# EAGLE schematic Keyboard (EAGLE 8.1.1)
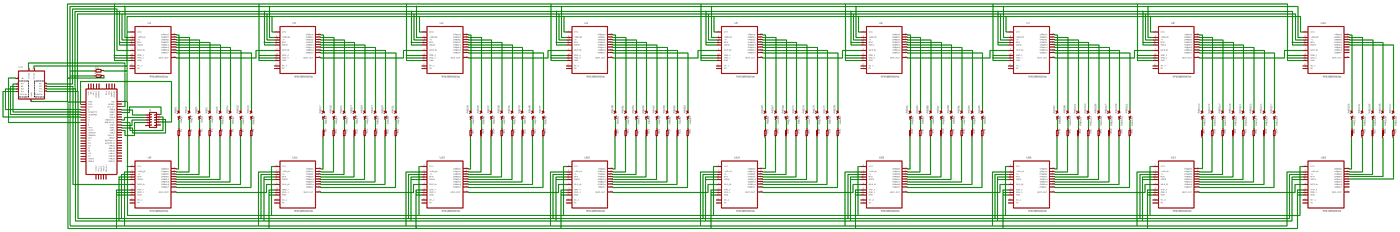
[diagram p0: schematic, sheet 1, overview]
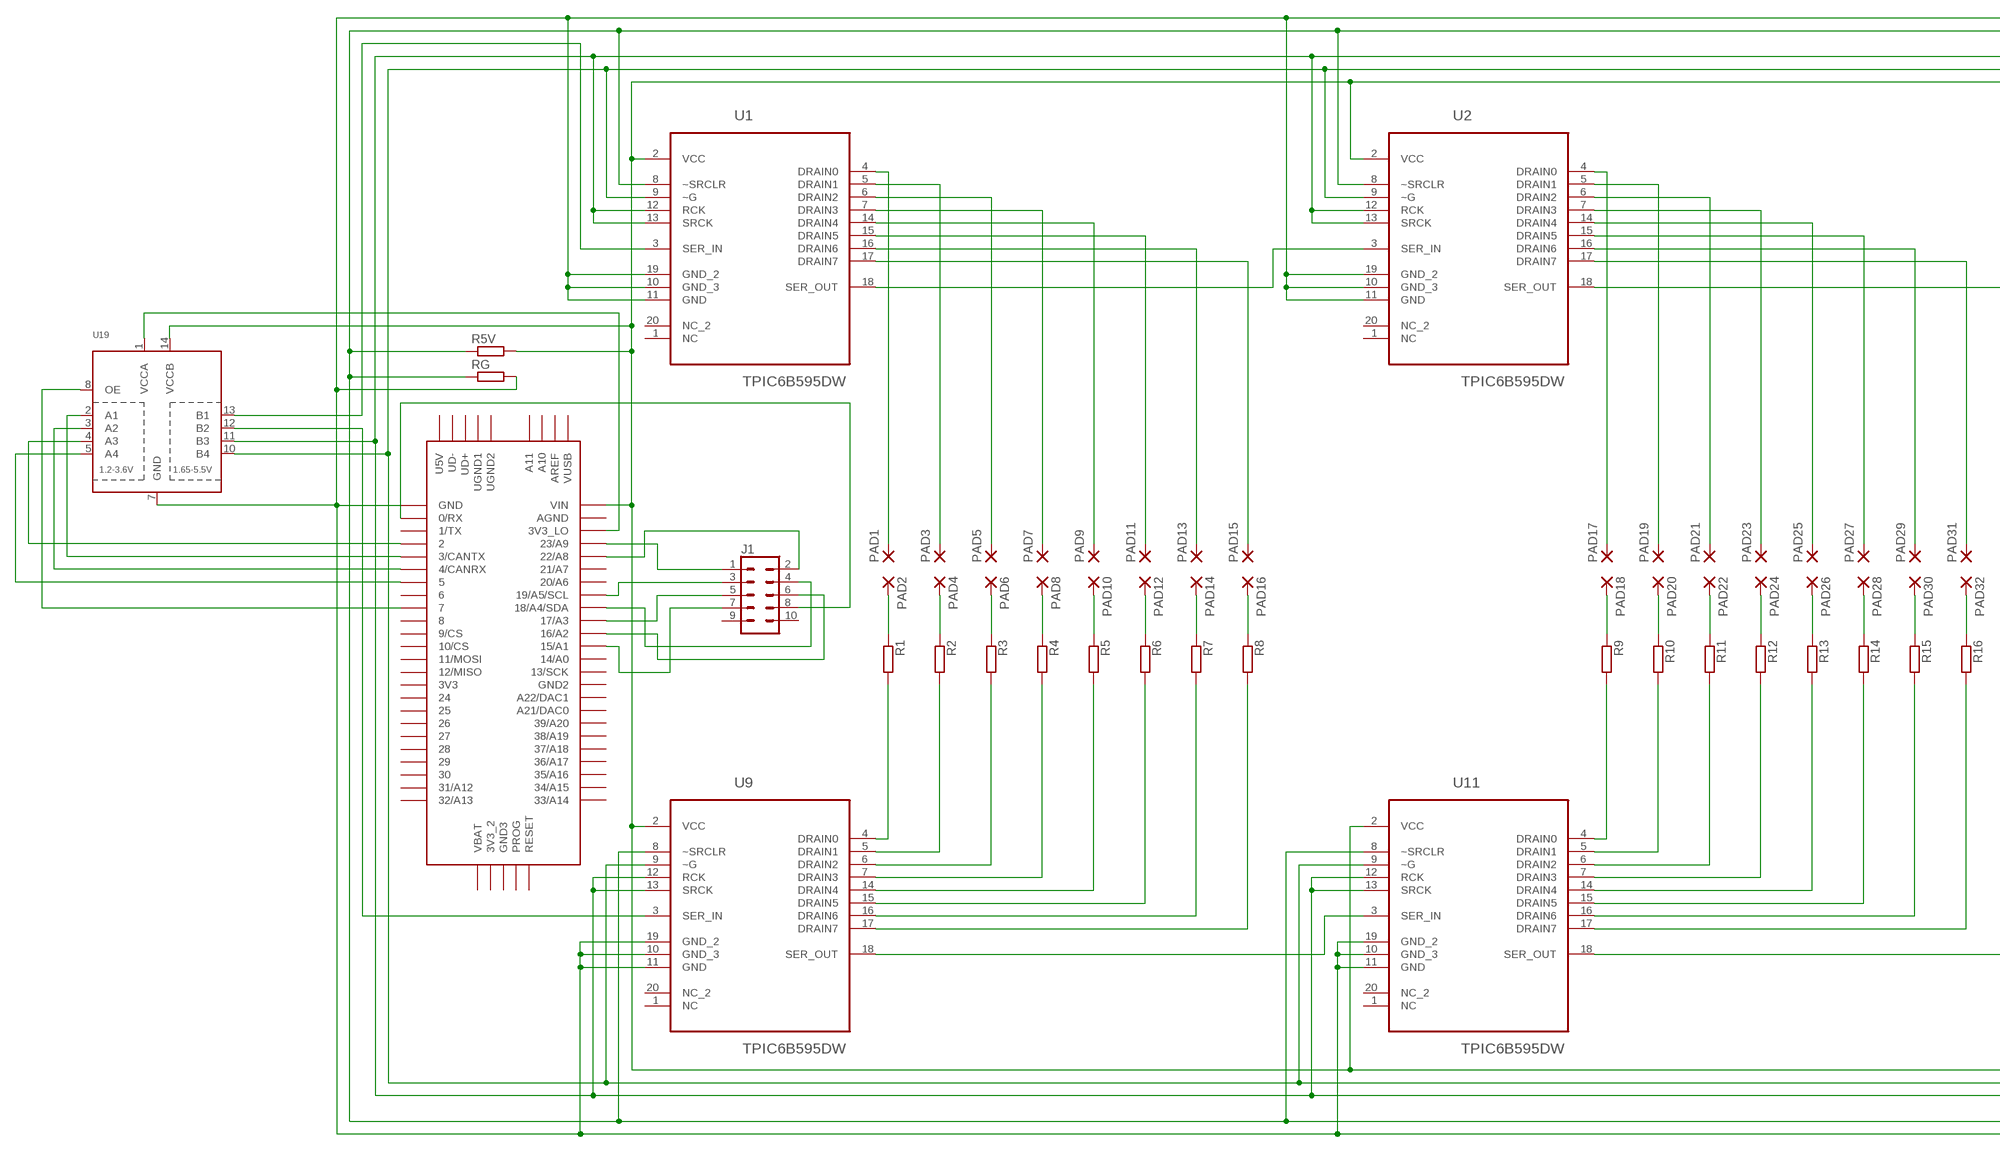
[diagram p1: schematic, sheet 1, part 1 of 4]
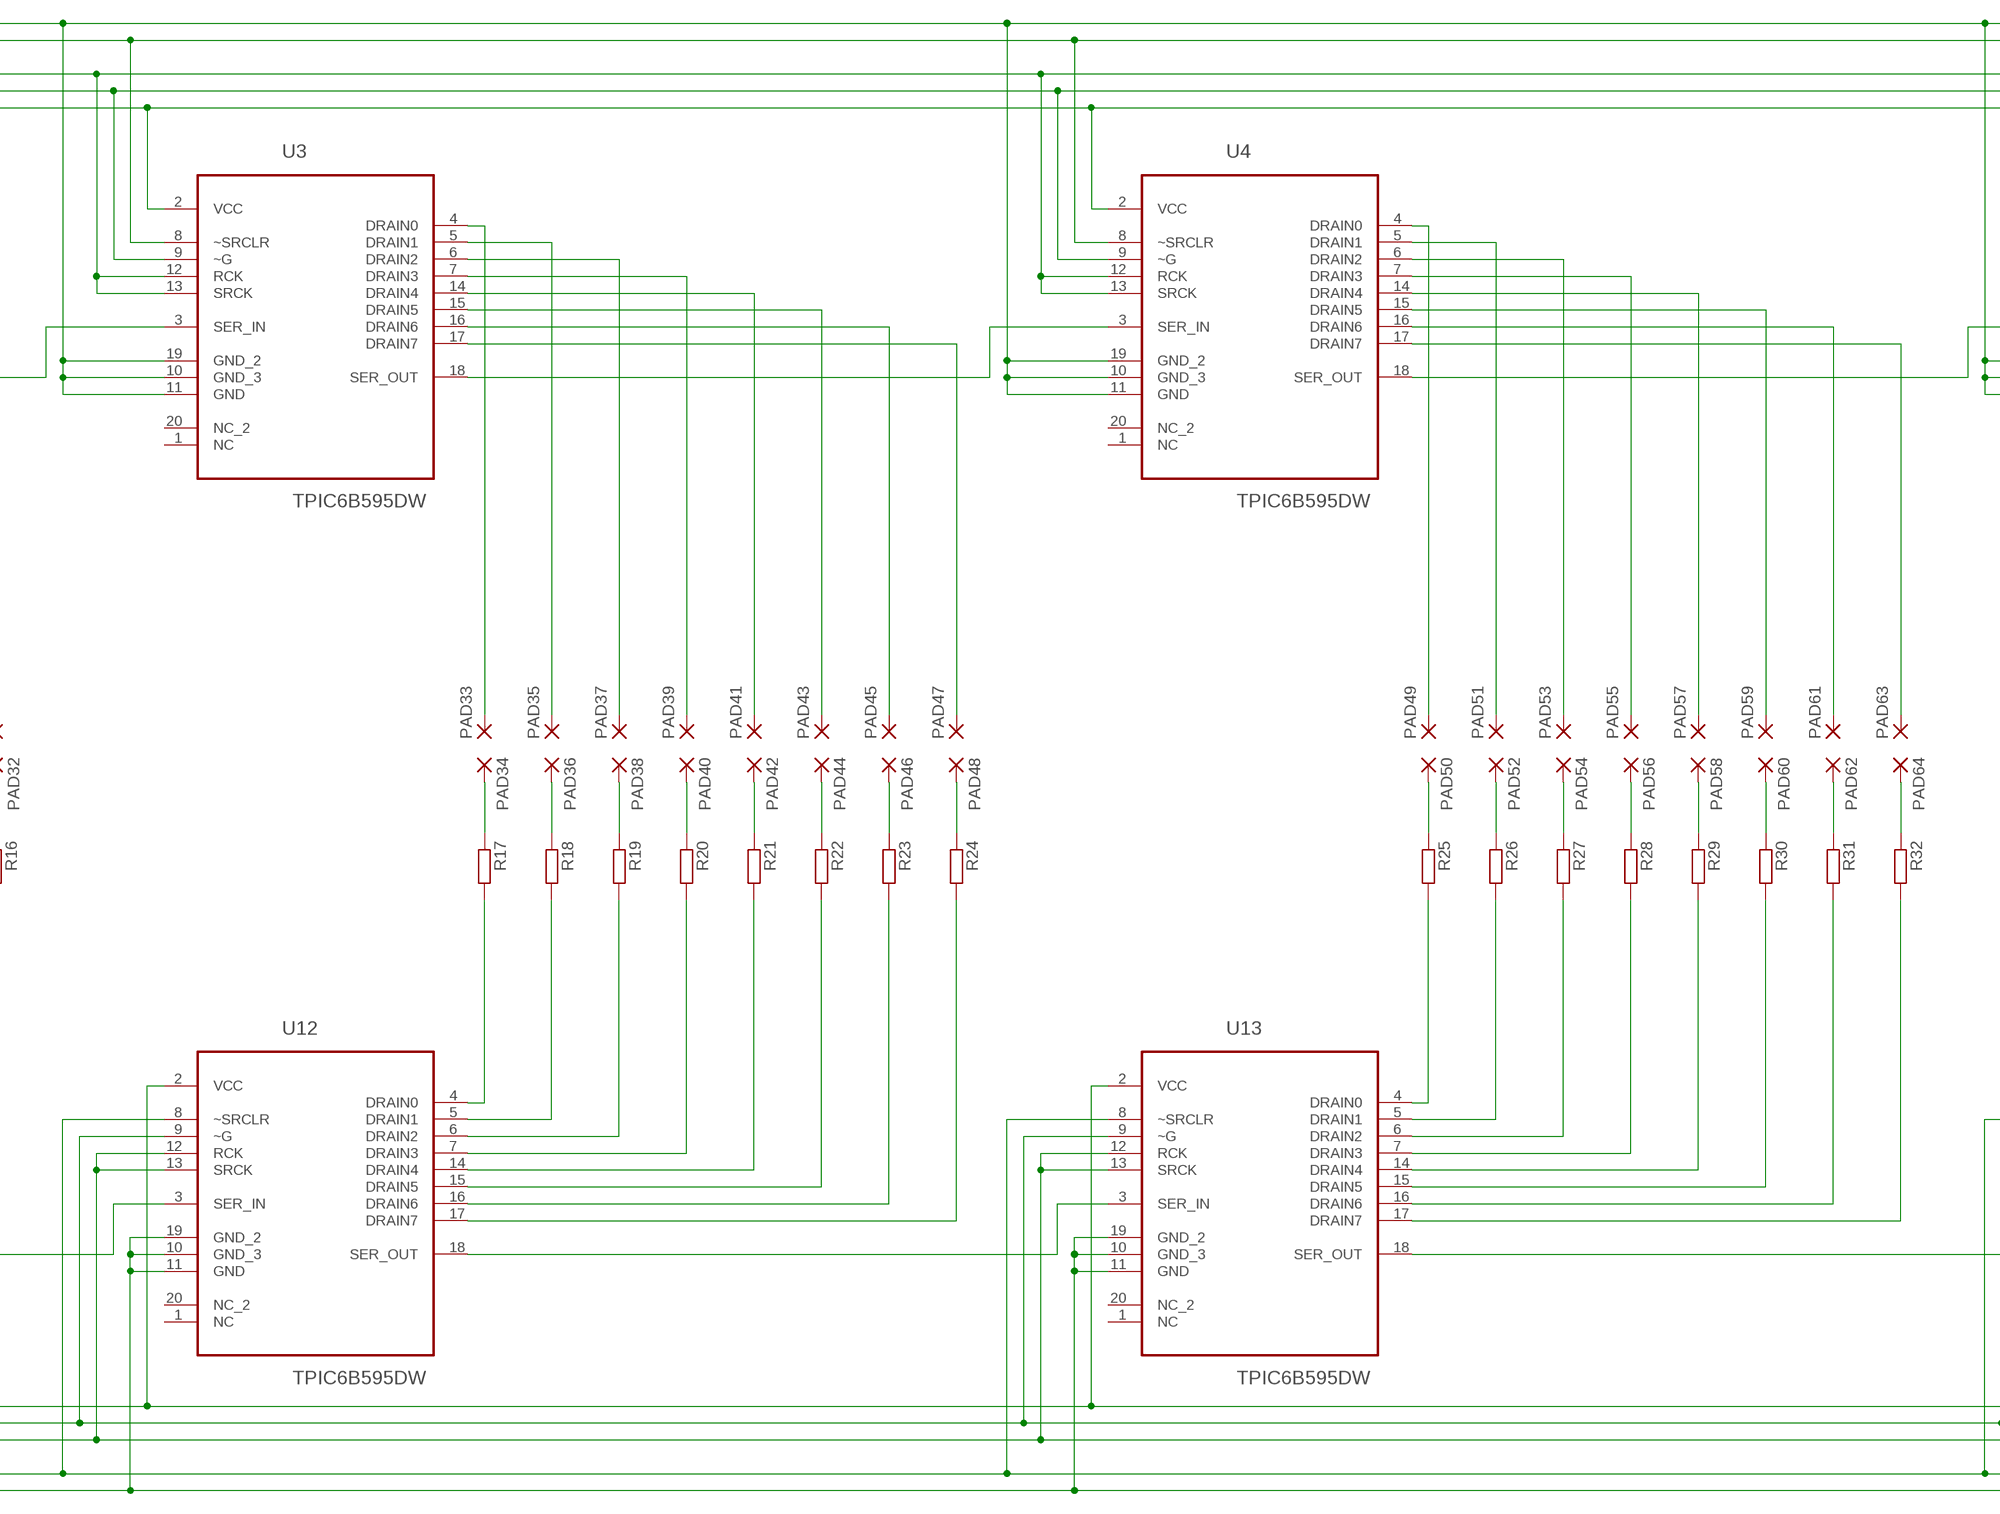
[diagram p2: schematic, sheet 1, part 2 of 4]
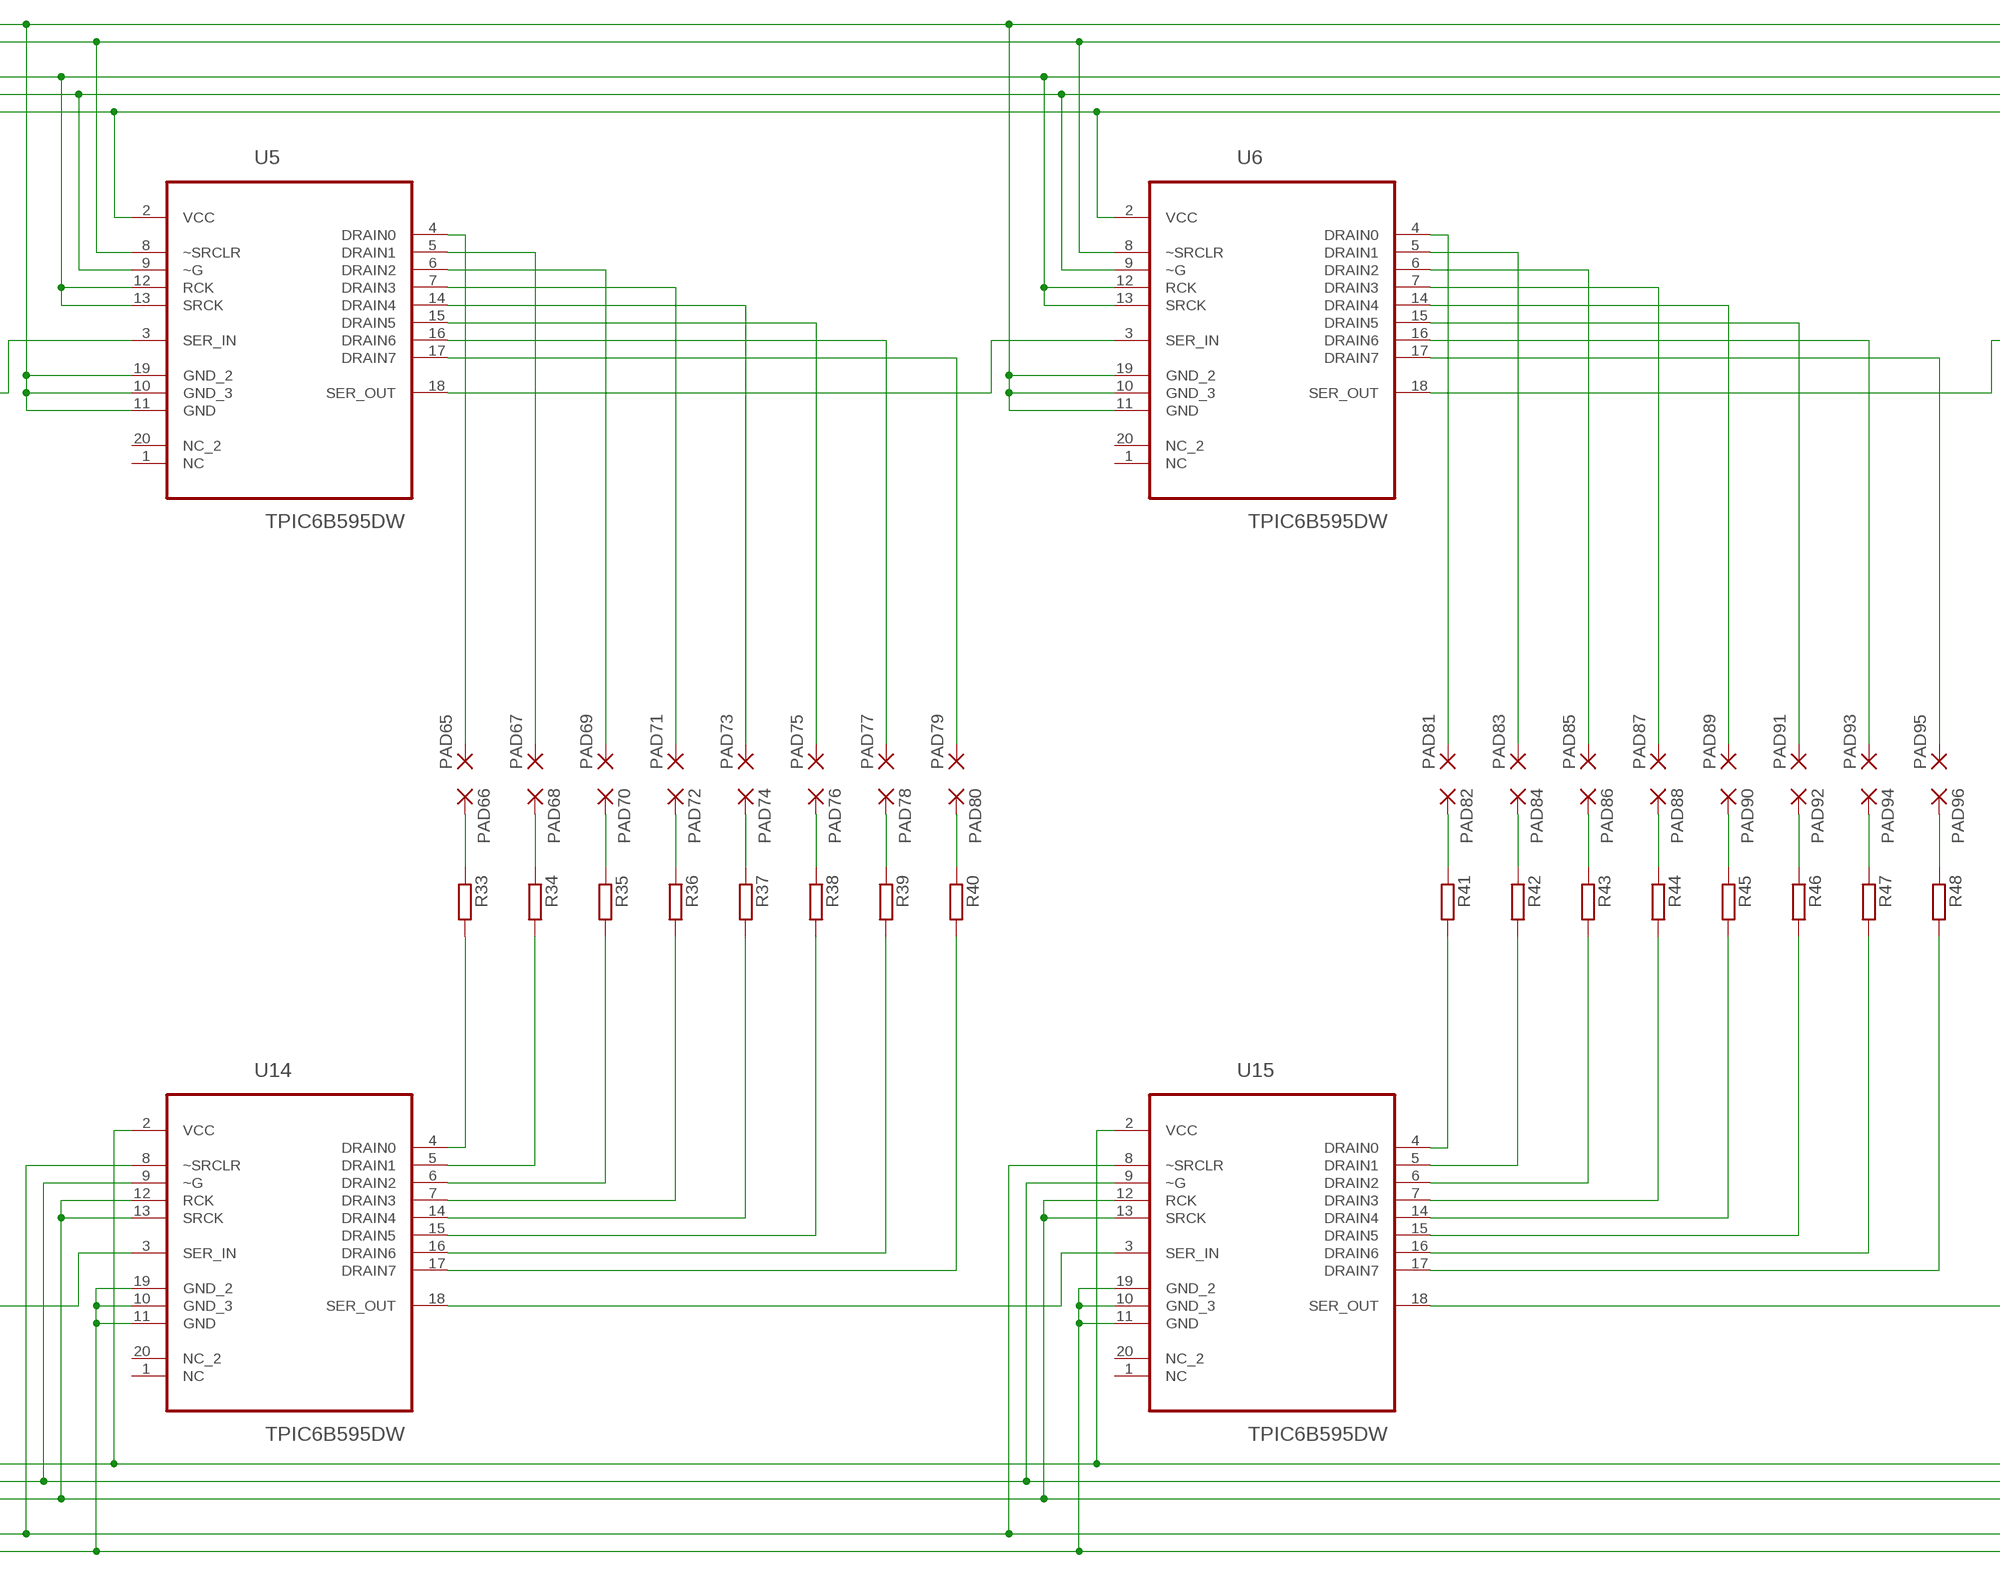
[diagram p3: schematic, sheet 1, part 3 of 4]
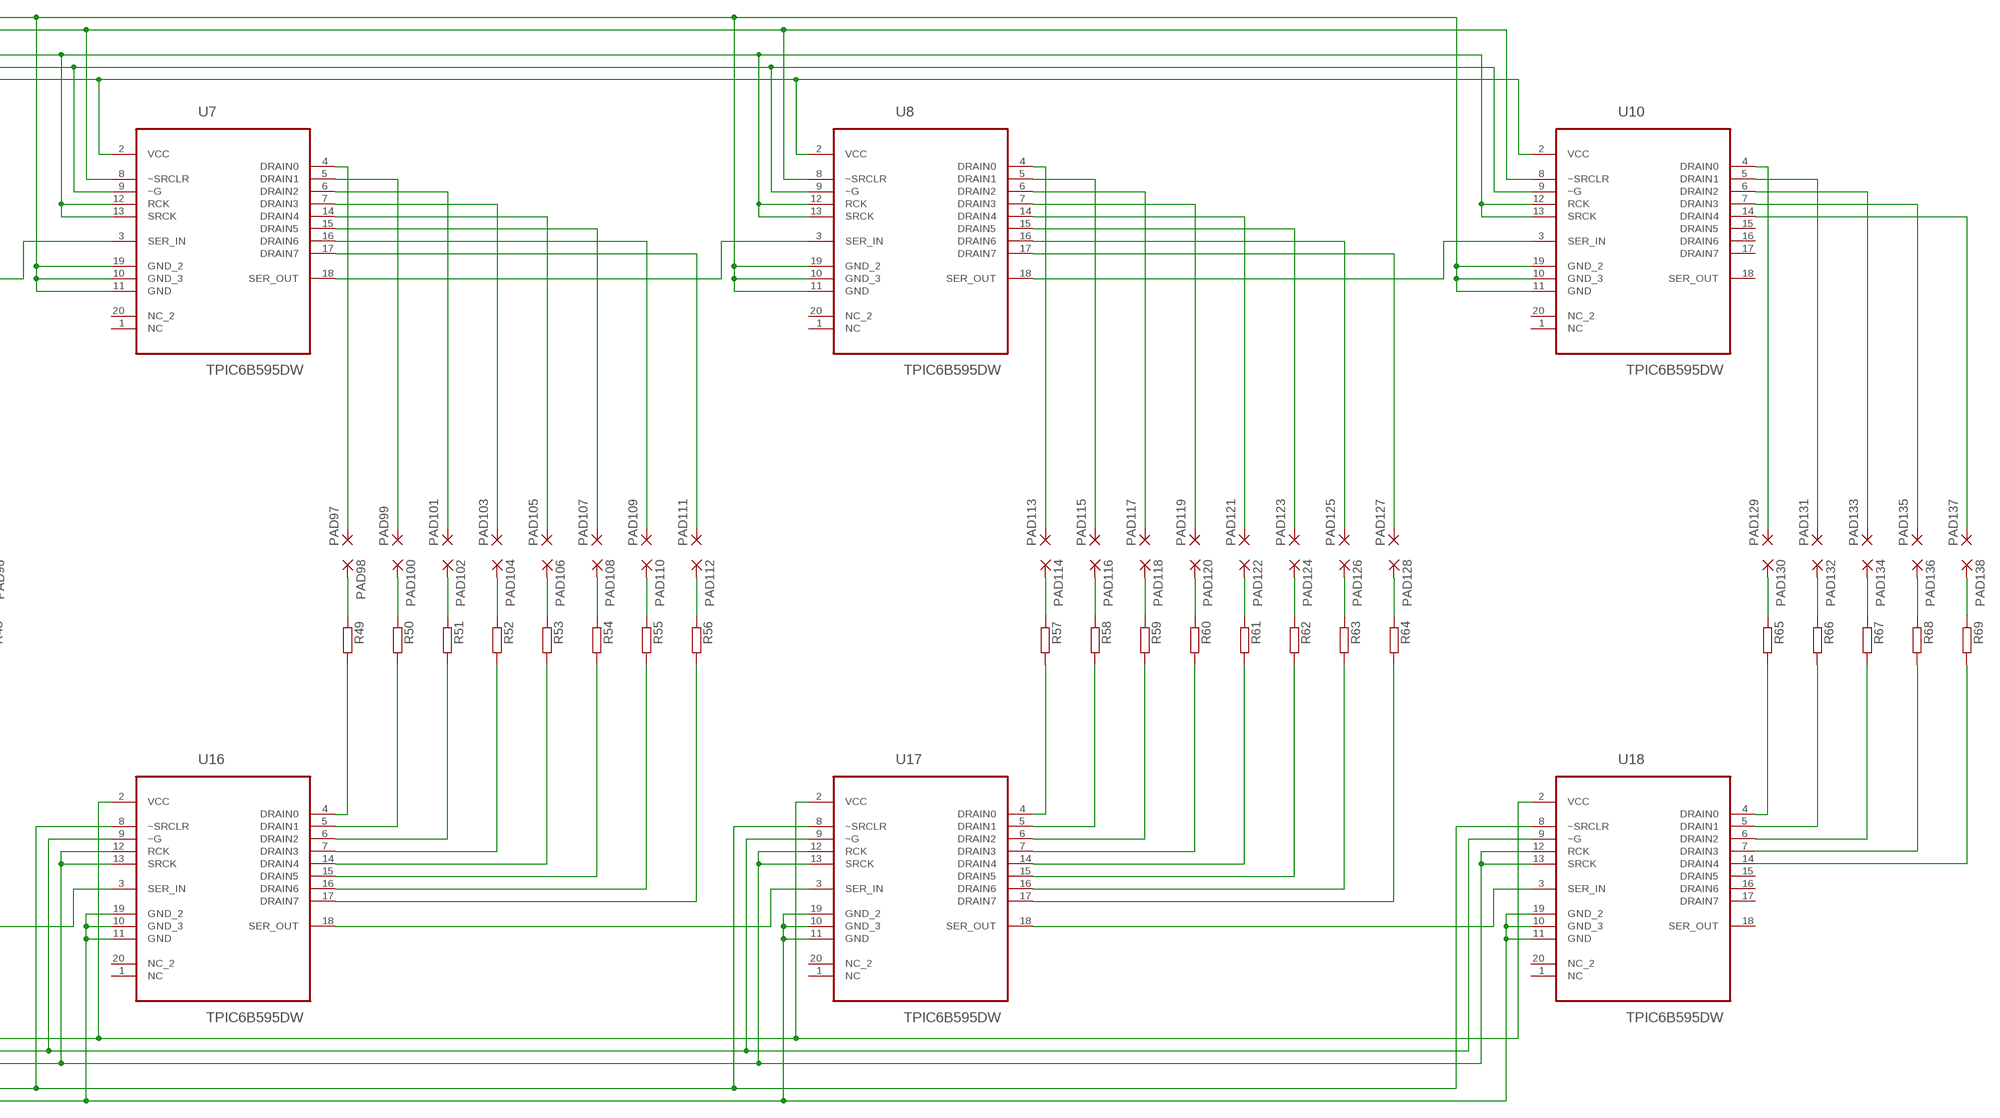
[diagram p4: schematic, sheet 1, part 4 of 4]

## Parts
J1  CONN_05X2SHD  [2X5-SHROUDED]
PAD1  1,6/0,8  [1,6/0,8]
PAD2  1,6/0,8  [1,6/0,8]
PAD3  1,6/0,8  [1,6/0,8]
PAD4  1,6/0,8  [1,6/0,8]
PAD5  1,6/0,8  [1,6/0,8]
PAD6  1,6/0,8  [1,6/0,8]
PAD7  1,6/0,8  [1,6/0,8]
PAD8  1,6/0,8  [1,6/0,8]
PAD9  1,6/0,8  [1,6/0,8]
PAD10  1,6/0,8  [1,6/0,8]
PAD11  1,6/0,8  [1,6/0,8]
PAD12  1,6/0,8  [1,6/0,8]
PAD13  1,6/0,8  [1,6/0,8]
PAD14  1,6/0,8  [1,6/0,8]
PAD15  1,6/0,8  [1,6/0,8]
PAD16  1,6/0,8  [1,6/0,8]
PAD17  1,6/0,8  [1,6/0,8]
PAD18  1,6/0,8  [1,6/0,8]
PAD19  1,6/0,8  [1,6/0,8]
PAD20  1,6/0,8  [1,6/0,8]
PAD21  1,6/0,8  [1,6/0,8]
PAD22  1,6/0,8  [1,6/0,8]
PAD23  1,6/0,8  [1,6/0,8]
PAD24  1,6/0,8  [1,6/0,8]
PAD25  1,6/0,8  [1,6/0,8]
PAD26  1,6/0,8  [1,6/0,8]
PAD27  1,6/0,8  [1,6/0,8]
PAD28  1,6/0,8  [1,6/0,8]
PAD29  1,6/0,8  [1,6/0,8]
PAD30  1,6/0,8  [1,6/0,8]
PAD31  1,6/0,8  [1,6/0,8]
PAD32  1,6/0,8  [1,6/0,8]
PAD33  1,6/0,8  [1,6/0,8]
PAD34  1,6/0,8  [1,6/0,8]
PAD35  1,6/0,8  [1,6/0,8]
PAD36  1,6/0,8  [1,6/0,8]
PAD37  1,6/0,8  [1,6/0,8]
PAD38  1,6/0,8  [1,6/0,8]
PAD39  1,6/0,8  [1,6/0,8]
PAD40  1,6/0,8  [1,6/0,8]
PAD41  1,6/0,8  [1,6/0,8]
PAD42  1,6/0,8  [1,6/0,8]
PAD43  1,6/0,8  [1,6/0,8]
PAD44  1,6/0,8  [1,6/0,8]
PAD45  1,6/0,8  [1,6/0,8]
PAD46  1,6/0,8  [1,6/0,8]
PAD47  1,6/0,8  [1,6/0,8]
PAD48  1,6/0,8  [1,6/0,8]
PAD49  1,6/0,8  [1,6/0,8]
PAD50  1,6/0,8  [1,6/0,8]
PAD51  1,6/0,8  [1,6/0,8]
PAD52  1,6/0,8  [1,6/0,8]
PAD53  1,6/0,8  [1,6/0,8]
PAD54  1,6/0,8  [1,6/0,8]
PAD55  1,6/0,8  [1,6/0,8]
PAD56  1,6/0,8  [1,6/0,8]
PAD57  1,6/0,8  [1,6/0,8]
PAD58  1,6/0,8  [1,6/0,8]
PAD59  1,6/0,8  [1,6/0,8]
PAD60  1,6/0,8  [1,6/0,8]
PAD61  1,6/0,8  [1,6/0,8]
PAD62  1,6/0,8  [1,6/0,8]
PAD63  1,6/0,8  [1,6/0,8]
PAD64  1,6/0,8  [1,6/0,8]
PAD65  1,6/0,8  [1,6/0,8]
PAD66  1,6/0,8  [1,6/0,8]
PAD67  1,6/0,8  [1,6/0,8]
PAD68  1,6/0,8  [1,6/0,8]
PAD69  1,6/0,8  [1,6/0,8]
PAD70  1,6/0,8  [1,6/0,8]
PAD71  1,6/0,8  [1,6/0,8]
PAD72  1,6/0,8  [1,6/0,8]
PAD73  1,6/0,8  [1,6/0,8]
PAD74  1,6/0,8  [1,6/0,8]
PAD75  1,6/0,8  [1,6/0,8]
PAD76  1,6/0,8  [1,6/0,8]
PAD77  1,6/0,8  [1,6/0,8]
PAD78  1,6/0,8  [1,6/0,8]
PAD79  1,6/0,8  [1,6/0,8]
PAD80  1,6/0,8  [1,6/0,8]
PAD81  1,6/0,8  [1,6/0,8]
PAD82  1,6/0,8  [1,6/0,8]
PAD83  1,6/0,8  [1,6/0,8]
PAD84  1,6/0,8  [1,6/0,8]
PAD85  1,6/0,8  [1,6/0,8]
PAD86  1,6/0,8  [1,6/0,8]
PAD87  1,6/0,8  [1,6/0,8]
PAD88  1,6/0,8  [1,6/0,8]
PAD89  1,6/0,8  [1,6/0,8]
PAD90  1,6/0,8  [1,6/0,8]
PAD91  1,6/0,8  [1,6/0,8]
PAD92  1,6/0,8  [1,6/0,8]
PAD93  1,6/0,8  [1,6/0,8]
PAD94  1,6/0,8  [1,6/0,8]
PAD95  1,6/0,8  [1,6/0,8]
PAD96  1,6/0,8  [1,6/0,8]
PAD97  1,6/0,8  [1,6/0,8]
PAD98  1,6/0,8  [1,6/0,8]
PAD99  1,6/0,8  [1,6/0,8]
PAD100  1,6/0,8  [1,6/0,8]
PAD101  1,6/0,8  [1,6/0,8]
PAD102  1,6/0,8  [1,6/0,8]
PAD103  1,6/0,8  [1,6/0,8]
PAD104  1,6/0,8  [1,6/0,8]
PAD105  1,6/0,8  [1,6/0,8]
PAD106  1,6/0,8  [1,6/0,8]
PAD107  1,6/0,8  [1,6/0,8]
PAD108  1,6/0,8  [1,6/0,8]
PAD109  1,6/0,8  [1,6/0,8]
PAD110  1,6/0,8  [1,6/0,8]
PAD111  1,6/0,8  [1,6/0,8]
PAD112  1,6/0,8  [1,6/0,8]
PAD113  1,6/0,8  [1,6/0,8]
PAD114  1,6/0,8  [1,6/0,8]
PAD115  1,6/0,8  [1,6/0,8]
PAD116  1,6/0,8  [1,6/0,8]
PAD117  1,6/0,8  [1,6/0,8]
PAD118  1,6/0,8  [1,6/0,8]
PAD119  1,6/0,8  [1,6/0,8]
PAD120  1,6/0,8  [1,6/0,8]
PAD121  1,6/0,8  [1,6/0,8]
PAD122  1,6/0,8  [1,6/0,8]
PAD123  1,6/0,8  [1,6/0,8]
PAD124  1,6/0,8  [1,6/0,8]
PAD125  1,6/0,8  [1,6/0,8]
PAD126  1,6/0,8  [1,6/0,8]
PAD127  1,6/0,8  [1,6/0,8]
PAD128  1,6/0,8  [1,6/0,8]
PAD129  1,6/0,8  [1,6/0,8]
PAD130  1,6/0,8  [1,6/0,8]
PAD131  1,6/0,8  [1,6/0,8]
PAD132  1,6/0,8  [1,6/0,8]
PAD133  1,6/0,8  [1,6/0,8]
PAD134  1,6/0,8  [1,6/0,8]
PAD135  1,6/0,8  [1,6/0,8]
PAD136  1,6/0,8  [1,6/0,8]
PAD137  1,6/0,8  [1,6/0,8]
PAD138  1,6/0,8  [1,6/0,8]
R1  R  [R0805]
R2  R  [R0805]
R3  R  [R0805]
R4  R  [R0805]
R5  R  [R0805]
R5V  R  [R0805]
R6  R  [R0805]
R7  R  [R0805]
R8  R  [R0805]
R9  R  [R0805]
R10  R  [R0805]
R11  R  [R0805]
R12  R  [R0805]
R13  R  [R0805]
R14  R  [R0805]
R15  R  [R0805]
R16  R  [R0805]
R17  R  [R0805]
R18  R  [R0805]
R19  R  [R0805]
R20  R  [R0805]
R21  R  [R0805]
R22  R  [R0805]
R23  R  [R0805]
R24  R  [R0805]
R25  R  [R0805]
R26  R  [R0805]
R27  R  [R0805]
R28  R  [R0805]
R29  R  [R0805]
R30  R  [R0805]
R31  R  [R0805]
R32  R  [R0805]
R33  R  [R0805]
R34  R  [R0805]
R35  R  [R0805]
R36  R  [R0805]
R37  R  [R0805]
R38  R  [R0805]
R39  R  [R0805]
R40  R  [R0805]
R41  R  [R0805]
R42  R  [R0805]
R43  R  [R0805]
R44  R  [R0805]
R45  R  [R0805]
R46  R  [R0805]
R47  R  [R0805]
R48  R  [R0805]
R49  R  [R0805]
R50  R  [R0805]
R51  R  [R0805]
R52  R  [R0805]
R53  R  [R0805]
R54  R  [R0805]
R55  R  [R0805]
R56  R  [R0805]
R57  R  [R0805]
R58  R  [R0805]
R59  R  [R0805]
R60  R  [R0805]
R61  R  [R0805]
R62  R  [R0805]
R63  R  [R0805]
R64  R  [R0805]
R65  R  [R0805]
R66  R  [R0805]
R67  R  [R0805]
R68  R  [R0805]
R69  R  [R0805]
RG  R  [R0805]
U1  TPIC6B595DW  [SOIC127P1030X265-20N]
U2  TPIC6B595DW  [SOIC127P1030X265-20N]
U3  TPIC6B595DW  [SOIC127P1030X265-20N]
U4  TPIC6B595DW  [SOIC127P1030X265-20N]
U5  TPIC6B595DW  [SOIC127P1030X265-20N]
U6  TPIC6B595DW  [SOIC127P1030X265-20N]
U7  TPIC6B595DW  [SOIC127P1030X265-20N]
U8  TPIC6B595DW  [SOIC127P1030X265-20N]
U9  TPIC6B595DW  [SOIC127P1030X265-20N]
U10  TPIC6B595DW  [SOIC127P1030X265-20N]
U11  TPIC6B595DW  [SOIC127P1030X265-20N]
U12  TPIC6B595DW  [SOIC127P1030X265-20N]
U13  TPIC6B595DW  [SOIC127P1030X265-20N]
U14  TPIC6B595DW  [SOIC127P1030X265-20N]
U15  TPIC6B595DW  [SOIC127P1030X265-20N]
U16  TPIC6B595DW  [SOIC127P1030X265-20N]
U17  TPIC6B595DW  [SOIC127P1030X265-20N]
U18  TPIC6B595DW  [SOIC127P1030X265-20N]
U19  TXB0104PWRSOIC14  [SO14]
U$59  TEENSY_3.5/3.6  [TEENSY_3.5/3.6]

## Nets
N$1: PAD2.1(P) R1.1
N$2: U1.18(SER_OUT) U2.3(SER_IN)
N$3: U1.12(RCK) U1.13(SRCK) U2.12(RCK) U2.13(SRCK) U3.12(RCK) U3.13(SRCK) U4.12(RCK) U4.13(SRCK) U5.12(RCK) U5.13(SRCK) U6.12(RCK) U6.13(SRCK) U7.12(RCK) U7.13(SRCK) U8.12(RCK) U8.13(SRCK) U9.12(RCK) U9.13(SRCK) U10.12(RCK) U10.13(SRCK) U11.12(RCK) U11.13(SRCK) U12.12(RCK) U12.13(SRCK) U13.12(RCK) U13.13(SRCK) U14.12(RCK) U14.13(SRCK) U15.12(RCK) U15.13(SRCK) U16.12(RCK) U16.13(SRCK) U17.12(RCK) U17.13(SRCK) U18.12(RCK) U18.13(SRCK) U19.11(B3)
N$4: PAD4.1(P) R2.1
N$5: PAD6.1(P) R3.1
N$6: PAD8.1(P) R4.1
N$7: PAD10.1(P) R5.1
N$8: PAD12.1(P) R6.1
N$9: PAD14.1(P) R7.1
N$10: PAD16.1(P) R8.1
N$11: PAD18.1(P) R9.1
N$12: U1.9(~G) U2.9(~G) U3.9(~G) U4.9(~G) U5.9(~G) U6.9(~G) U7.9(~G) U8.9(~G) U9.9(~G) U10.9(~G) U11.9(~G) U12.9(~G) U13.9(~G) U14.9(~G) U15.9(~G) U16.9(~G) U17.9(~G) U18.9(~G) U19.10(B4)
N$13: PAD20.1(P) R10.1
N$14: PAD22.1(P) R11.1
N$15: PAD24.1(P) R12.1
N$16: PAD26.1(P) R13.1
N$17: PAD28.1(P) R14.1
N$18: PAD30.1(P) R15.1
N$19: PAD32.1(P) R16.1
N$20: PAD34.1(P) R17.1
N$21: PAD36.1(P) R18.1
N$22: PAD38.1(P) R19.1
N$23: PAD40.1(P) R20.1
N$24: PAD42.1(P) R21.1
N$25: PAD44.1(P) R22.1
N$26: PAD46.1(P) R23.1
N$27: PAD48.1(P) R24.1
N$28: PAD50.1(P) R25.1
N$29: PAD52.1(P) R26.1
N$30: PAD54.1(P) R27.1
N$31: PAD56.1(P) R28.1
N$32: PAD58.1(P) R29.1
N$33: PAD60.1(P) R30.1
N$34: PAD62.1(P) R31.1
N$35: PAD64.1(P) R32.1
N$36: PAD66.1(P) R33.1
N$37: PAD68.1(P) R34.1
N$38: PAD70.1(P) R35.1
N$39: PAD72.1(P) R36.1
N$40: PAD74.1(P) R37.1
N$41: PAD76.1(P) R38.1
N$42: PAD78.1(P) R39.1
N$43: PAD80.1(P) R40.1
N$44: PAD82.1(P) R41.1
N$45: PAD84.1(P) R42.1
N$46: PAD86.1(P) R43.1
N$47: PAD88.1(P) R44.1
N$48: PAD90.1(P) R45.1
N$49: PAD92.1(P) R46.1
N$50: PAD94.1(P) R47.1
N$51: PAD96.1(P) R48.1
N$52: PAD98.1(P) R49.1
N$53: PAD100.1(P) R50.1
N$54: PAD102.1(P) R51.1
N$55: PAD104.1(P) R52.1
N$56: PAD106.1(P) R53.1
N$57: PAD108.1(P) R54.1
N$58: PAD110.1(P) R55.1
N$59: PAD112.1(P) R56.1
N$60: PAD114.1(P) R57.1
N$61: R5V.2 U1.2(VCC) U2.2(VCC) U3.2(VCC) U4.2(VCC) U5.2(VCC) U6.2(VCC) U7.2(VCC) U8.2(VCC) U9.2(VCC) U10.2(VCC) U11.2(VCC) U12.2(VCC) U13.2(VCC) U14.2(VCC) U15.2(VCC) U16.2(VCC) U17.2(VCC) U18.2(VCC) U19.14(VCCB) U$59.VIN
N$62: U19.4(A3) U$59.2
N$63: R5V.1 RG.1 U1.8(~SRCLR) U2.8(~SRCLR) U3.8(~SRCLR) U4.8(~SRCLR) U5.8(~SRCLR) U6.8(~SRCLR) U7.8(~SRCLR) U8.8(~SRCLR) U9.8(~SRCLR) U10.8(~SRCLR) U11.8(~SRCLR) U12.8(~SRCLR) U13.8(~SRCLR) U14.8(~SRCLR) U15.8(~SRCLR) U16.8(~SRCLR) U17.8(~SRCLR) U18.8(~SRCLR)
N$64: U1.3(SER_IN) U19.13(B1)
N$65: U2.18(SER_OUT) U3.3(SER_IN)
N$66: R68.2 U18.7(DRAIN3)
N$67: R69.2 U18.14(DRAIN4)
N$68: PAD129.1(P) U10.4(DRAIN0)
N$69: PAD131.1(P) U10.5(DRAIN1)
N$70: U3.18(SER_OUT) U4.3(SER_IN)
N$71: U4.18(SER_OUT) U5.3(SER_IN)
N$72: U5.18(SER_OUT) U6.3(SER_IN)
N$73: U6.18(SER_OUT) U7.3(SER_IN)
N$74: U7.18(SER_OUT) U8.3(SER_IN)
N$75: U8.18(SER_OUT) U10.3(SER_IN)
N$76: U19.1(VCCA) U$59.3V3_LO
N$77: U19.2(A1) U$59.3/CANTX
N$78: U9.3(SER_IN) U19.12(B2)
N$79: U19.8(OE) U$59.7
N$80: PAD116.1(P) R58.1
N$81: PAD118.1(P) R59.1
N$82: PAD120.1(P) R60.1
N$83: PAD122.1(P) R61.1
N$84: PAD124.1(P) R62.1
N$85: PAD126.1(P) R63.1
N$86: PAD128.1(P) R64.1
N$87: U9.18(SER_OUT) U11.3(SER_IN)
N$88: U11.18(SER_OUT) U12.3(SER_IN)
N$89: U12.18(SER_OUT) U13.3(SER_IN)
N$90: U13.18(SER_OUT) U14.3(SER_IN)
N$91: U14.18(SER_OUT) U15.3(SER_IN)
N$92: U15.18(SER_OUT) U16.3(SER_IN)
N$93: U16.18(SER_OUT) U17.3(SER_IN)
N$94: U17.18(SER_OUT) U18.3(SER_IN)
N$95: RG.2 U1.10(GND_3) U1.11(GND) U1.19(GND_2) U2.10(GND_3) U2.11(GND) U2.19(GND_2) U3.10(GND_3) U3.11(GND) U3.19(GND_2) U4.10(GND_3) U4.11(GND) U4.19(GND_2) U5.10(GND_3) U5.11(GND) U5.19(GND_2) U6.10(GND_3) U6.11(GND) U6.19(GND_2) U7.10(GND_3) U7.11(GND) U7.19(GND_2) U8.10(GND_3) U8.11(GND) U8.19(GND_2) U9.10(GND_3) U9.11(GND) U9.19(GND_2) U10.10(GND_3) U10.11(GND) U10.19(GND_2) U11.10(GND_3) U11.11(GND) U11.19(GND_2) U12.10(GND_3) U12.11(GND) U12.19(GND_2) U13.10(GND_3) U13.11(GND) U13.19(GND_2) U14.10(GND_3) U14.11(GND) U14.19(GND_2) U15.10(GND_3) U15.11(GND) U15.19(GND_2) U16.10(GND_3) U16.11(GND) U16.19(GND_2) U17.10(GND_3) U17.11(GND) U17.19(GND_2) U18.10(GND_3) U18.11(GND) U18.19(GND_2) U19.7(GND) U$59.GND
N$96: U19.5(A4) U$59.5
N$97: PAD130.1(P) R65.1
N$98: PAD1.1(P) U1.4(DRAIN0)
N$99: PAD3.1(P) U1.5(DRAIN1)
N$100: PAD5.1(P) U1.6(DRAIN2)
N$101: PAD7.1(P) U1.7(DRAIN3)
N$102: PAD9.1(P) U1.14(DRAIN4)
N$103: PAD11.1(P) U1.15(DRAIN5)
N$104: PAD13.1(P) U1.16(DRAIN6)
N$105: PAD15.1(P) U1.17(DRAIN7)
N$106: R1.2 U9.4(DRAIN0)
N$107: R2.2 U9.5(DRAIN1)
N$108: R3.2 U9.6(DRAIN2)
N$109: R4.2 U9.7(DRAIN3)
N$110: R5.2 U9.14(DRAIN4)
N$111: R6.2 U9.15(DRAIN5)
N$112: R7.2 U9.16(DRAIN6)
N$113: R8.2 U9.17(DRAIN7)
N$114: R9.2 U11.4(DRAIN0)
N$115: R10.2 U11.5(DRAIN1)
N$116: R11.2 U11.6(DRAIN2)
N$117: R12.2 U11.7(DRAIN3)
N$118: R13.2 U11.14(DRAIN4)
N$119: R14.2 U11.15(DRAIN5)
N$120: R15.2 U11.16(DRAIN6)
N$121: R16.2 U11.17(DRAIN7)
N$122: PAD17.1(P) U2.4(DRAIN0)
N$123: PAD19.1(P) U2.5(DRAIN1)
N$124: PAD21.1(P) U2.6(DRAIN2)
N$125: PAD23.1(P) U2.7(DRAIN3)
N$126: PAD25.1(P) U2.14(DRAIN4)
N$127: PAD27.1(P) U2.15(DRAIN5)
N$128: PAD29.1(P) U2.16(DRAIN6)
N$129: PAD31.1(P) U2.17(DRAIN7)
N$130: PAD33.1(P) U3.4(DRAIN0)
N$131: PAD35.1(P) U3.5(DRAIN1)
N$132: PAD37.1(P) U3.6(DRAIN2)
N$133: PAD39.1(P) U3.7(DRAIN3)
N$134: PAD41.1(P) U3.14(DRAIN4)
N$135: PAD43.1(P) U3.15(DRAIN5)
N$136: PAD45.1(P) U3.16(DRAIN6)
N$137: PAD47.1(P) U3.17(DRAIN7)
N$138: R17.2 U12.4(DRAIN0)
N$139: R18.2 U12.5(DRAIN1)
N$140: R19.2 U12.6(DRAIN2)
N$141: R20.2 U12.7(DRAIN3)
N$142: R21.2 U12.14(DRAIN4)
N$143: R22.2 U12.15(DRAIN5)
N$144: R23.2 U12.16(DRAIN6)
N$145: R24.2 U12.17(DRAIN7)
N$146: R25.2 U13.4(DRAIN0)
N$147: R26.2 U13.5(DRAIN1)
N$148: R27.2 U13.6(DRAIN2)
N$149: U19.3(A2) U$59.4/CANRX
N$150: R28.2 U13.7(DRAIN3)
N$151: R29.2 U13.14(DRAIN4)
N$152: R30.2 U13.15(DRAIN5)
N$153: R31.2 U13.16(DRAIN6)
N$154: R32.2 U13.17(DRAIN7)
N$155: PAD49.1(P) U4.4(DRAIN0)
N$156: PAD51.1(P) U4.5(DRAIN1)
N$157: PAD53.1(P) U4.6(DRAIN2)
N$158: PAD55.1(P) U4.7(DRAIN3)
N$159: PAD57.1(P) U4.14(DRAIN4)
N$160: PAD59.1(P) U4.15(DRAIN5)
N$161: PAD61.1(P) U4.16(DRAIN6)
N$162: PAD63.1(P) U4.17(DRAIN7)
N$163: PAD65.1(P) U5.4(DRAIN0)
N$164: PAD67.1(P) U5.5(DRAIN1)
N$165: PAD69.1(P) U5.6(DRAIN2)
N$166: PAD71.1(P) U5.7(DRAIN3)
N$167: PAD73.1(P) U5.14(DRAIN4)
N$168: PAD75.1(P) U5.15(DRAIN5)
N$169: PAD77.1(P) U5.16(DRAIN6)
N$170: PAD79.1(P) U5.17(DRAIN7)
N$171: R33.2 U14.4(DRAIN0)
N$172: R34.2 U14.5(DRAIN1)
N$173: R35.2 U14.6(DRAIN2)
N$174: R36.2 U14.7(DRAIN3)
N$175: R37.2 U14.14(DRAIN4)
N$176: R38.2 U14.15(DRAIN5)
N$177: R39.2 U14.16(DRAIN6)
N$178: R40.2 U14.17(DRAIN7)
N$179: R41.2 U15.4(DRAIN0)
N$180: R42.2 U15.5(DRAIN1)
N$181: R43.2 U15.6(DRAIN2)
N$182: R44.2 U15.7(DRAIN3)
N$183: R45.2 U15.14(DRAIN4)
N$184: R46.2 U15.15(DRAIN5)
N$185: R47.2 U15.16(DRAIN6)
N$186: R48.2 U15.17(DRAIN7)
N$187: PAD81.1(P) U6.4(DRAIN0)
N$188: PAD83.1(P) U6.5(DRAIN1)
N$189: PAD85.1(P) U6.6(DRAIN2)
N$190: PAD87.1(P) U6.7(DRAIN3)
N$191: PAD89.1(P) U6.14(DRAIN4)
N$192: PAD91.1(P) U6.15(DRAIN5)
N$193: PAD93.1(P) U6.16(DRAIN6)
N$194: PAD95.1(P) U6.17(DRAIN7)
N$195: R49.2 U16.4(DRAIN0)
N$196: R50.2 U16.5(DRAIN1)
N$197: R51.2 U16.6(DRAIN2)
N$198: R52.2 U16.7(DRAIN3)
N$199: R53.2 U16.14(DRAIN4)
N$200: R54.2 U16.15(DRAIN5)
N$201: R55.2 U16.16(DRAIN6)
N$202: R56.2 U16.17(DRAIN7)
N$203: PAD97.1(P) U7.4(DRAIN0)
N$204: PAD99.1(P) U7.5(DRAIN1)
N$205: PAD101.1(P) U7.6(DRAIN2)
N$206: PAD103.1(P) U7.7(DRAIN3)
N$207: PAD105.1(P) U7.14(DRAIN4)
N$208: PAD107.1(P) U7.15(DRAIN5)
N$209: PAD109.1(P) U7.16(DRAIN6)
N$210: PAD111.1(P) U7.17(DRAIN7)
N$211: PAD113.1(P) U8.4(DRAIN0)
N$212: PAD115.1(P) U8.5(DRAIN1)
N$213: PAD117.1(P) U8.6(DRAIN2)
N$214: PAD119.1(P) U8.7(DRAIN3)
N$215: PAD121.1(P) U8.14(DRAIN4)
N$216: PAD123.1(P) U8.15(DRAIN5)
N$217: PAD125.1(P) U8.16(DRAIN6)
N$218: PAD127.1(P) U8.17(DRAIN7)
N$219: R57.2 U17.4(DRAIN0)
N$220: R58.2 U17.5(DRAIN1)
N$221: R59.2 U17.6(DRAIN2)
N$222: R60.2 U17.7(DRAIN3)
N$223: R61.2 U17.14(DRAIN4)
N$224: R62.2 U17.15(DRAIN5)
N$225: R63.2 U17.16(DRAIN6)
N$226: R64.2 U17.17(DRAIN7)
N$227: R65.2 U18.4(DRAIN0)
N$228: R66.2 U18.5(DRAIN1)
N$229: R67.2 U18.6(DRAIN2)
N$230: PAD132.1(P) R66.1
N$231: PAD134.1(P) R67.1
N$232: PAD136.1(P) R68.1
N$233: PAD138.1(P) R69.1
N$234: PAD133.1(P) U10.6(DRAIN2)
N$235: PAD135.1(P) U10.7(DRAIN3)
N$236: PAD137.1(P) U10.14(DRAIN4)
N$237: J1.1 U$59.23/A9
N$238: J1.2 U$59.22/A8
N$239: J1.3 U$59.19/A5/SCL
N$240: J1.4 U$59.18/A4/SDA
N$241: J1.5 U$59.17/A3
N$242: J1.6 U$59.16/A2
N$243: J1.7 U$59.15/A1
N$244: J1.8 U$59.0/RX
Unconnected: J1.9 J1.10 U1.1(NC) U1.20(NC_2) U2.1(NC) U2.20(NC_2) U3.1(NC) U3.20(NC_2) U4.1(NC) U4.20(NC_2) U5.1(NC) U5.20(NC_2) U6.1(NC) U6.20(NC_2) U7.1(NC) U7.20(NC_2) U8.1(NC) U8.20(NC_2) U9.1(NC) U9.20(NC_2) U10.1(NC) U10.15(DRAIN5) U10.16(DRAIN6) U10.17(DRAIN7) U10.18(SER_OUT) U10.20(NC_2) U11.1(NC) U11.20(NC_2) U12.1(NC) U12.20(NC_2) U13.1(NC) U13.20(NC_2) U14.1(NC) U14.20(NC_2) U15.1(NC) U15.20(NC_2) U16.1(NC) U16.20(NC_2) U17.1(NC) U17.20(NC_2) U18.1(NC) U18.15(DRAIN5) U18.16(DRAIN6) U18.17(DRAIN7) U18.18(SER_OUT) U18.20(NC_2) U$59.1/TX U$59.3V3 U$59.3V3_2 U$59.6 U$59.8 U$59.9/CS U$59.10/CS U$59.11/MOSI U$59.12/MISO U$59.13/SCK U$59.14/A0 U$59.20/A6 U$59.21/A7 U$59.21/DAC0(A21/DAC0) U$59.24 U$59.25 U$59.26 U$59.27 U$59.28 U$59.29 U$59.30 U$59.31/A12 U$59.32/A13 U$59.33/A14 U$59.34/A15 U$59.35/A16 U$59.36/A17 U$59.37/A18 U$59.38/A19 U$59.39/A20 U$59.A10 U$59.A11 U$59.A22/DAC1 U$59.AGND U$59.AREF U$59.GND2 U$59.GND3 U$59.PROG U$59.RESET U$59.U5V U$59.UD+ U$59.UD- U$59.UGND1 U$59.UGND2 U$59.VBAT U$59.VUSB

## Library data of the parts
J1 = SparkFun-Connectors:CONN_05X2: Multi connection point. Often used as Generic Header-pin footprint for 0.1 inch spaced/style header connections For AVR SPI programming port, see special device with nice symbol: "AVR_SPI_PROG_5x2.dev" You can populate with any combo of single row headers, but if you'd like an exact match, check these: 2x5 AVR ICSP Male Header <https://www.sparkfun.com/products/778> (PRT-00778) 2x5 Pin Shrouded Header <https://www.sparkfun.com/products/8506> (PRT-08506) On any of the 0.1 inch spaced packages, you can populate with these: Break Away Headers - Straight <https://www.sparkfun.com/products/116> (PRT-00116) Break Away Male Headers - Right Angle <https://www.sparkfun.com/products/553> (PRT-00553) Female Headers <https://www.sparkfun.com/products/115> (PRT-00115) Break Away Headers - Machine Pin <https://www.sparkfun.com/products/117> (PRT-00117) Break Away Female Headers - Swiss Machine Pin <https://www.sparkfun.com/products/743> (PRT-00743) Special note: the shrouded connector mates well with our 5x2 ribbon cables: 2x5 Pin IDC Ribbon Cable <https://www.sparkfun.com/products/8535> (PRT-08535); PROD_ID: CONN-08671; SF_ID: PRT-08506
PAD1-PAD138 = wirepad:1,6/0,8: THROUGH-HOLE PAD
R1-R5 R5V R6-R69 RG = eagle-ltspice:R: RESISTOR, European symbol; SPICEMODEL: NONE; SPICEPREFIX: R
U1-U18 = Texas Instruments_By_element14_Batch_1:TPIC6B595DW: Power Logic 8-Bit Shift Register; MPN: TPIC6B595DW; OC_FARNELL: 1491696; OC_NEWARK: 52F2783; PACKAGE: SOIC-20; SUPPLIER: Texas Instruments
U19 = SparkFun-DigitalIC:TXB0104PWR: 4-Bit Bi-Directional Level Shifter 1.2V-3.6V (VCCA) to 1.65V-5.5V (VCCB) bi-directional level shifter with auto direction sensing. Max data rate - VCCA 1.8V: 20Mbps (50ns), VCCA 3.3V: 100Mbps (10ns) Digikey: 296-21929-1-ND (TSSOP) IC-11329; PROD_ID: IC-11329
U$59 = Teensy356:TEENSY_3.5/3.6